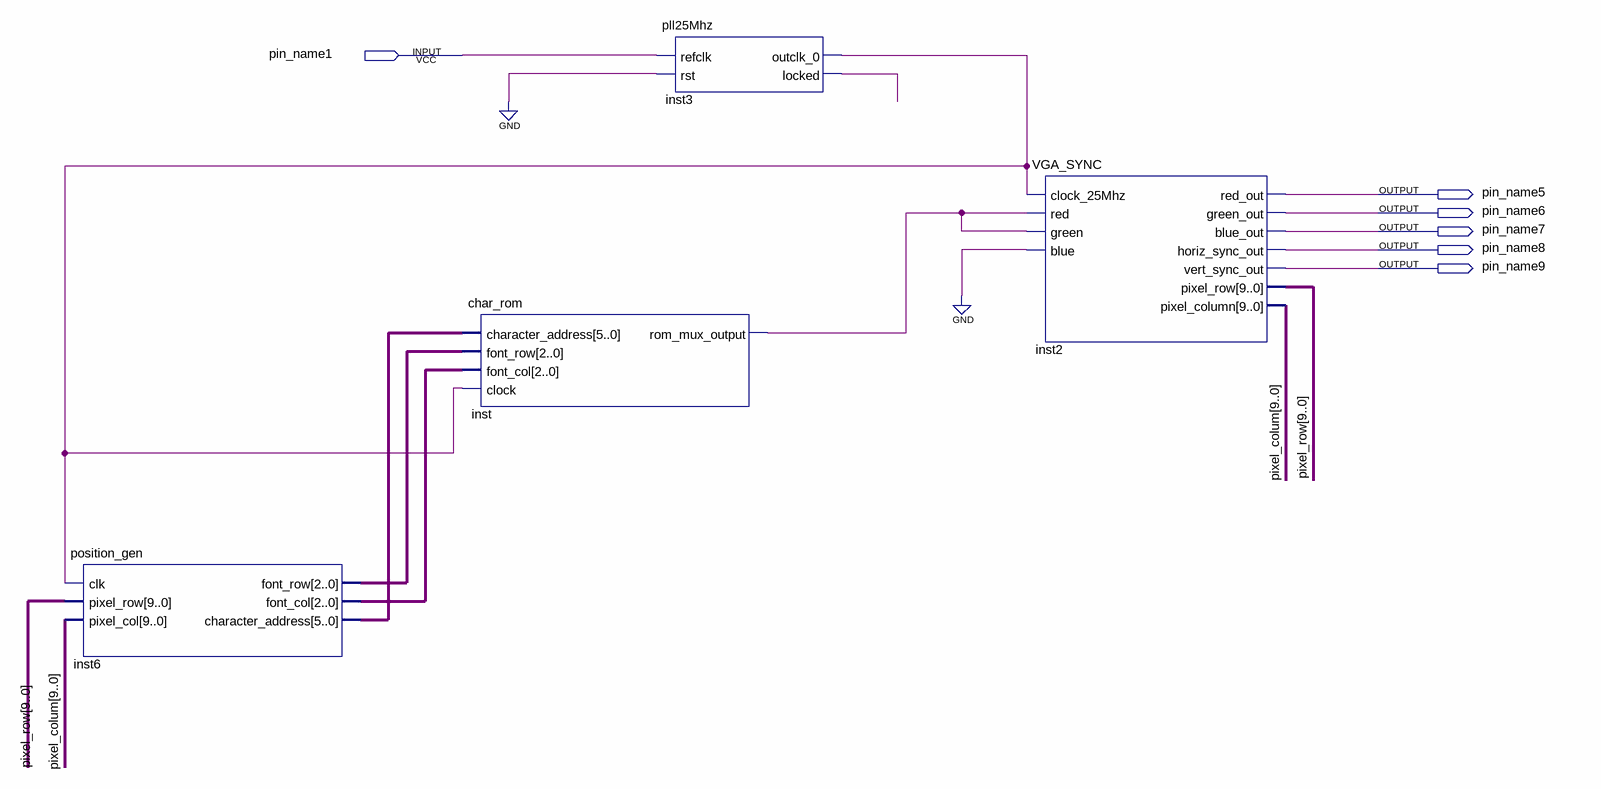
[diagram p0: schematic sheet]
// Quartus schematic text_display_testing.bdf as structural Verilog: 4 symbols, 6 pins
module text_display_testing (
  input  pin_name1,
  output pin_name5,
  output pin_name6,
  output pin_name7,
  output pin_name8,
  output pin_name9
);

  wire inst3_locked, inst3_outclk_0, inst_rom_mux_output;
  wire [2:0] inst6_font_col, inst6_font_row;
  wire [5:0] inst6_character_address;
  wire [9:0] pixel_colum, pixel_row;

  position_gen inst6 (
    .clk(inst3_outclk_0), .pixel_row(pixel_row), .pixel_col(pixel_colum), .font_row(inst6_font_row),
    .font_col(inst6_font_col), .character_address(inst6_character_address));
  char_rom inst (
    .character_address(inst6_character_address), .font_row(inst6_font_row), .font_col(inst6_font_col),
    .clock(inst3_outclk_0), .rom_mux_output(inst_rom_mux_output));
  pll25Mhz inst3 (.refclk(pin_name1), .rst(1'b0), .outclk_0(inst3_outclk_0), .locked(inst3_locked));
  VGA_SYNC inst2 (
    .clock_25Mhz(inst3_outclk_0), .red(inst_rom_mux_output), .green(inst_rom_mux_output), .blue(1'b0),
    .red_out(pin_name5), .green_out(pin_name6), .blue_out(pin_name7), .horiz_sync_out(pin_name8),
    .vert_sync_out(pin_name9), .pixel_row(pixel_row), .pixel_column(pixel_colum));
endmodule
